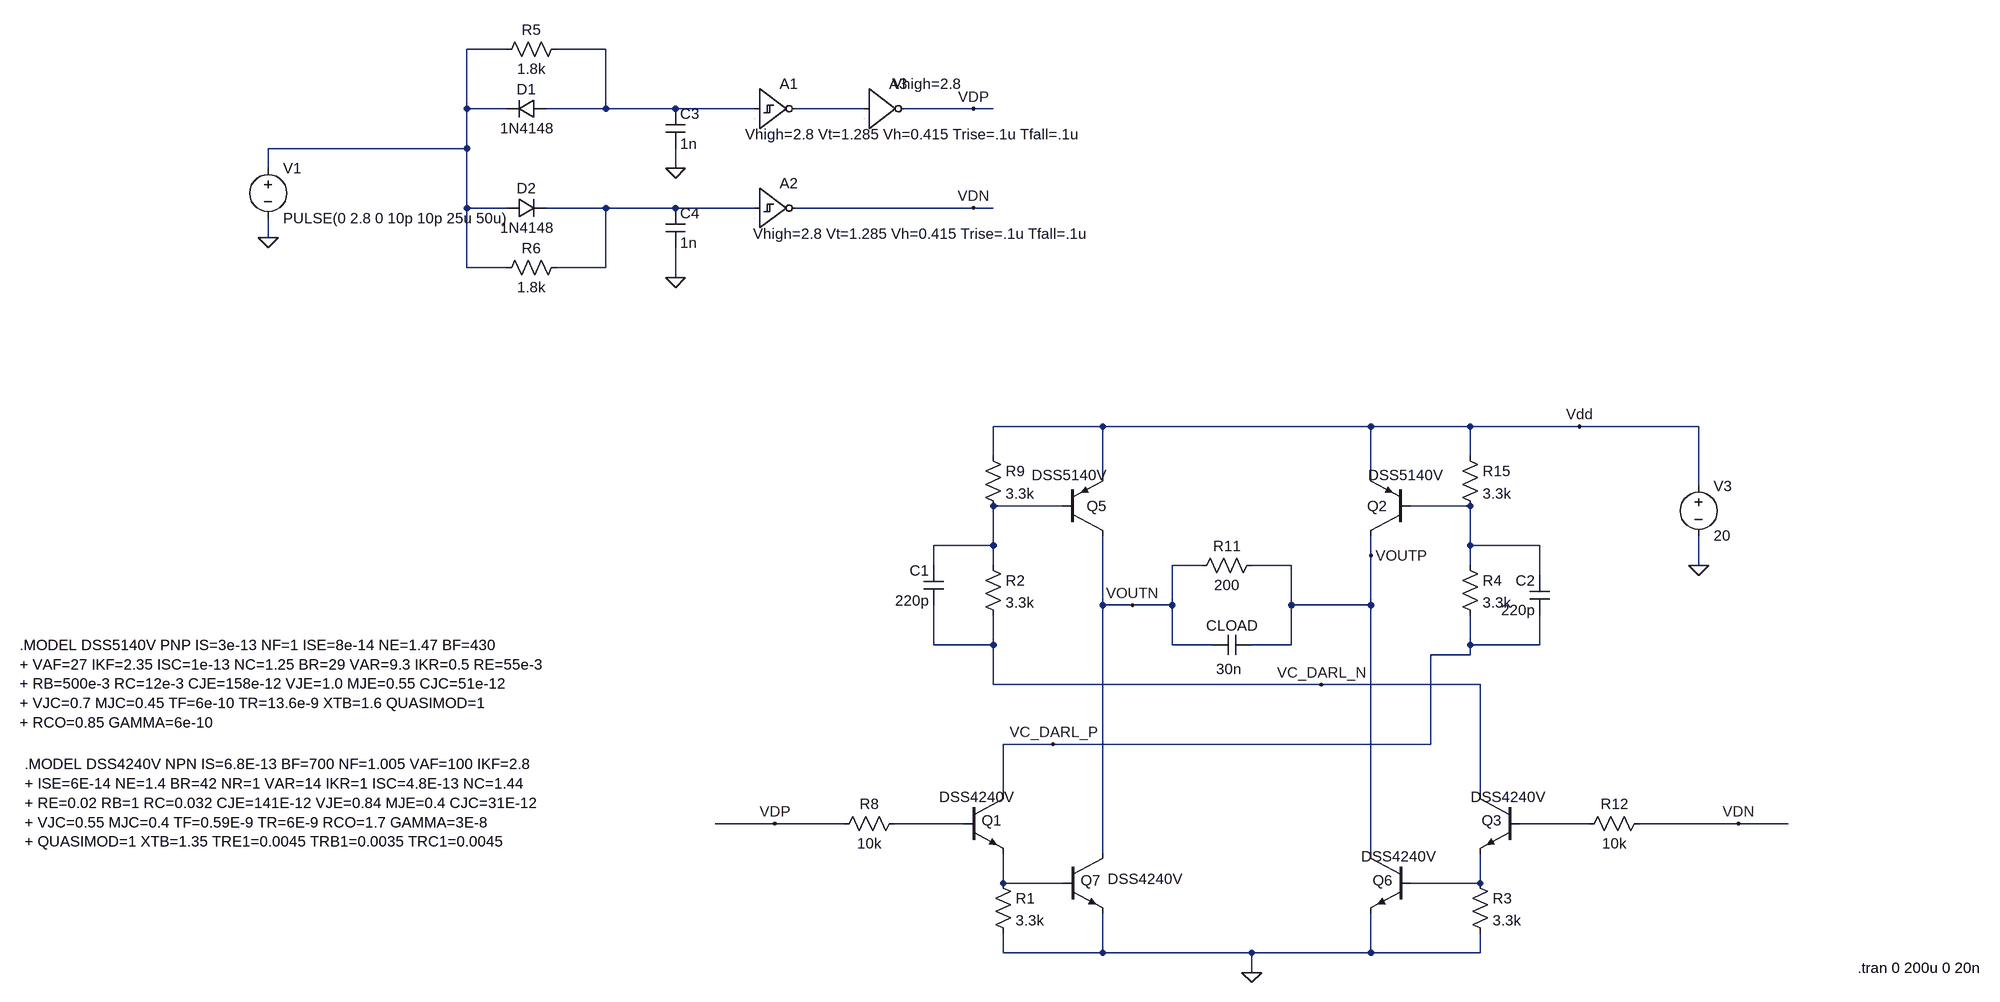
[diagram p0: schematic HbridgePiezo_bipolar.asc]
HbridgePiezo_bipolar.asc, the LTspice schematic file:
Version 4
SHEET 1 1368 680
WIRE -1136 -1296 -1200 -1296
WIRE -976 -1296 -1056 -1296
WIRE -1200 -1200 -1200 -1296
WIRE -1136 -1200 -1200 -1200
WIRE -976 -1200 -976 -1296
WIRE -976 -1200 -1072 -1200
WIRE -864 -1200 -976 -1200
WIRE -736 -1200 -864 -1200
WIRE -560 -1200 -672 -1200
WIRE -384 -1200 -496 -1200
WIRE -352 -1200 -384 -1200
WIRE -1200 -1136 -1200 -1200
WIRE -1200 -1136 -1520 -1136
WIRE -1520 -1104 -1520 -1136
WIRE -864 -1104 -864 -1136
WIRE -1200 -1040 -1200 -1136
WIRE -1136 -1040 -1200 -1040
WIRE -976 -1040 -1072 -1040
WIRE -864 -1040 -976 -1040
WIRE -736 -1040 -864 -1040
WIRE -384 -1040 -672 -1040
WIRE -352 -1040 -384 -1040
WIRE -1520 -992 -1520 -1024
WIRE -1200 -944 -1200 -1040
WIRE -1136 -944 -1200 -944
WIRE -976 -944 -976 -1040
WIRE -976 -944 -1056 -944
WIRE -864 -928 -864 -976
WIRE -176 -688 -352 -688
WIRE 256 -688 -176 -688
WIRE 416 -688 256 -688
WIRE 592 -688 416 -688
WIRE 784 -688 592 -688
WIRE -352 -640 -352 -688
WIRE 416 -640 416 -688
WIRE -176 -608 -176 -688
WIRE 256 -608 256 -688
WIRE 784 -592 784 -688
WIRE -240 -560 -352 -560
WIRE 416 -560 320 -560
WIRE -352 -496 -352 -560
WIRE -352 -496 -448 -496
WIRE 416 -496 416 -560
WIRE 528 -496 416 -496
WIRE 256 -480 256 -512
WIRE -448 -464 -448 -496
WIRE -352 -464 -352 -496
WIRE -16 -464 -64 -464
WIRE 128 -464 64 -464
WIRE 416 -464 416 -496
WIRE 784 -464 784 -512
WIRE 528 -448 528 -496
WIRE -176 -400 -176 -512
WIRE -128 -400 -176 -400
WIRE -64 -400 -64 -464
WIRE -64 -400 -128 -400
WIRE 128 -400 128 -464
WIRE 256 -400 256 -480
WIRE 256 -400 128 -400
WIRE -448 -336 -448 -400
WIRE -352 -336 -352 -384
WIRE -352 -336 -448 -336
WIRE -64 -336 -64 -400
WIRE 0 -336 -64 -336
WIRE 128 -336 128 -400
WIRE 128 -336 64 -336
WIRE 416 -336 416 -384
WIRE 528 -336 528 -384
WIRE 528 -336 416 -336
WIRE 416 -320 416 -336
WIRE 416 -320 352 -320
WIRE -352 -272 -352 -336
WIRE 176 -272 -352 -272
WIRE 432 -272 176 -272
WIRE -256 -176 -336 -176
WIRE 352 -176 352 -320
WIRE 352 -176 -256 -176
WIRE -336 -96 -336 -176
WIRE 432 -96 432 -272
WIRE -704 -48 -800 -48
WIRE -592 -48 -704 -48
WIRE -400 -48 -512 -48
WIRE 608 -48 496 -48
WIRE 848 -48 688 -48
WIRE 928 -48 848 -48
WIRE -176 0 -176 -400
WIRE 256 0 256 -400
WIRE -336 48 -336 0
WIRE -240 48 -336 48
WIRE 432 48 432 0
WIRE 432 48 320 48
WIRE -336 160 -336 128
WIRE -176 160 -176 96
WIRE -176 160 -336 160
WIRE 64 160 -176 160
WIRE 256 160 256 96
WIRE 256 160 64 160
WIRE 432 160 432 128
WIRE 432 160 256 160
WIRE 64 192 64 160
FLAG 784 -464 0
FLAG 64 192 0
FLAG 592 -688 Vdd
FLAG -704 -48 VDP
FLAG 848 -48 VDN
FLAG 256 -480 VOUTP
FLAG -128 -400 VOUTN
FLAG -864 -1104 0
FLAG -864 -928 0
FLAG -1520 -992 0
FLAG -384 -1200 VDP
FLAG -384 -1040 VDN
FLAG -256 -176 VC_DARL_P
FLAG 176 -272 VC_DARL_N
SYMBOL voltage -1520 -1120 R0
WINDOW 123 0 0 Left 2
WINDOW 39 0 0 Left 2
SYMATTR InstName V1
SYMATTR Value PULSE(0 2.8 0 10p 10p 25u 50u)
SYMBOL voltage 784 -608 R0
WINDOW 123 0 0 Left 2
WINDOW 39 24 124 Left 2
SYMATTR InstName V3
SYMATTR Value 20
SYMBOL res -352 32 R0
SYMATTR InstName R1
SYMATTR Value 3.3k
SYMATTR SpiceLine tol=1 pwr=0.0625
SYMBOL res 416 32 R0
SYMATTR InstName R3
SYMATTR Value 3.3k
SYMATTR SpiceLine tol=1 pwr=0.0625
SYMBOL res 400 -480 R0
SYMATTR InstName R4
SYMATTR Value 3.3k
SYMATTR SpiceLine tol=1 pwr=0.0625
SYMBOL diode -1072 -1216 R90
WINDOW 0 0 32 VBottom 2
WINDOW 3 32 32 VTop 2
SYMATTR InstName D1
SYMATTR Value 1N4148
SYMBOL diode -1136 -1024 R270
WINDOW 0 32 32 VTop 2
WINDOW 3 0 32 VBottom 2
SYMATTR InstName D2
SYMATTR Value 1N4148
SYMBOL res -1040 -1312 R90
WINDOW 0 0 56 VBottom 2
WINDOW 3 32 56 VTop 2
SYMATTR InstName R5
SYMATTR Value 1.8k
SYMATTR SpiceLine tol=5
SYMBOL res -1040 -960 R90
WINDOW 0 0 56 VBottom 2
WINDOW 3 32 56 VTop 2
SYMATTR InstName R6
SYMATTR Value 1.8k
SYMATTR SpiceLine tol=5
SYMBOL cap -880 -1200 R0
SYMATTR InstName C3
SYMATTR Value 1n
SYMBOL cap -880 -1040 R0
SYMATTR InstName C4
SYMATTR Value 1n
SYMBOL Digital\\schmtinv -736 -1264 R0
WINDOW 3 -16 105 Left 2
SYMATTR Value Vhigh=2.8 Vt=1.285 Vh=0.415 Trise=.1u Tfall=.1u
SYMATTR InstName A1
SYMBOL Digital\\schmtinv -736 -1104 R0
WINDOW 3 -3 105 Left 2
SYMATTR Value Vhigh=2.8 Vt=1.285 Vh=0.415 Trise=.1u Tfall=.1u
SYMATTR InstName A2
SYMBOL Digital\\inv -560 -1264 R0
WINDOW 3 45 24 Left 2
SYMATTR Value Vhigh=2.8
SYMATTR InstName A3
SYMBOL cap 64 -352 R90
WINDOW 0 0 32 VBottom 2
WINDOW 3 39 37 VTop 2
SYMATTR InstName CLOAD
SYMATTR Value 30n
SYMBOL npn 496 -96 M0
WINDOW 0 29 43 Left 2
WINDOW 3 -39 5 Left 2
SYMATTR InstName Q3
SYMATTR Value DSS4240V
SYMBOL res -496 -64 R90
WINDOW 0 0 56 VBottom 2
WINDOW 3 32 56 VTop 2
SYMATTR InstName R8
SYMATTR Value 10k
SYMATTR SpiceLine tol=1 pwr=0.0625
SYMBOL res 80 -480 R90
WINDOW 0 0 56 VBottom 2
WINDOW 3 32 56 VTop 2
SYMATTR InstName R11
SYMATTR Value 200
SYMBOL npn -400 -96 R0
WINDOW 0 29 43 Left 2
WINDOW 3 -39 5 Left 2
SYMATTR InstName Q1
SYMATTR Value DSS4240V
SYMBOL pnp 320 -512 R180
WINDOW 0 38 48 Left 2
WINDOW 3 -50 98 Left 2
SYMATTR InstName Q2
SYMATTR Value DSS5140V
SYMBOL pnp -240 -512 M180
WINDOW 0 38 48 Left 2
WINDOW 3 -50 98 Left 2
SYMATTR InstName Q5
SYMATTR Value DSS5140V
SYMBOL npn 320 0 M0
WINDOW 0 29 43 Left 2
WINDOW 3 -39 5 Left 2
SYMATTR InstName Q6
SYMATTR Value DSS4240V
SYMBOL npn -240 0 R0
WINDOW 0 29 43 Left 2
WINDOW 3 72 41 Left 2
SYMATTR InstName Q7
SYMATTR Value DSS4240V
SYMBOL res 704 -64 R90
WINDOW 0 0 56 VBottom 2
WINDOW 3 32 56 VTop 2
SYMATTR InstName R12
SYMATTR Value 10k
SYMATTR SpiceLine tol=1 pwr=0.0625
SYMBOL res -368 -656 R0
SYMATTR InstName R9
SYMATTR Value 3.3k
SYMATTR SpiceLine tol=1 pwr=0.0625
SYMBOL res 400 -656 R0
SYMATTR InstName R15
SYMATTR Value 3.3k
SYMATTR SpiceLine tol=1 pwr=0.0625
SYMBOL res -368 -480 R0
SYMATTR InstName R2
SYMATTR Value 3.3k
SYMATTR SpiceLine tol=1 pwr=0.0625
SYMBOL cap -432 -400 R180
WINDOW 0 24 56 Left 2
WINDOW 3 24 8 Left 2
SYMATTR InstName C1
SYMATTR Value 220p
SYMBOL cap 544 -384 R180
WINDOW 0 24 56 Left 2
WINDOW 3 24 8 Left 2
SYMATTR InstName C2
SYMATTR Value 220p
TEXT 1040 184 Left 2 !.tran 0 200u 0 20n
TEXT -1912 -144 Left 2 !.MODEL DSS4240V NPN IS=6.8E-13 BF=700 NF=1.005 VAF=100 IKF=2.8\n+ ISE=6E-14 NE=1.4 BR=42 NR=1 VAR=14 IKR=1 ISC=4.8E-13 NC=1.44\n+ RE=0.02 RB=1 RC=0.032 CJE=141E-12 VJE=0.84 MJE=0.4 CJC=31E-12\n+ VJC=0.55 MJC=0.4 TF=0.59E-9 TR=6E-9 RCO=1.7 GAMMA=3E-8\n+ QUASIMOD=1 XTB=1.35 TRE1=0.0045 TRB1=0.0035 TRC1=0.0045
TEXT -1920 -336 Left 2 !.MODEL DSS5140V PNP IS=3e-13 NF=1 ISE=8e-14 NE=1.47 BF=430\n+ VAF=27 IKF=2.35 ISC=1e-13 NC=1.25 BR=29 VAR=9.3 IKR=0.5 RE=55e-3\n+ RB=500e-3 RC=12e-3 CJE=158e-12 VJE=1.0 MJE=0.55 CJC=51e-12\n+ VJC=0.7 MJC=0.45 TF=6e-10 TR=13.6e-9 XTB=1.6 QUASIMOD=1\n+ RCO=0.85 GAMMA=6e-10

The netlist it stands for:
* HbridgePiezo_bipolar.asc
V1 N001 0 PULSE(0 2.8 0 10p 10p 25u 50u)
V3 Vdd 0 20
R1 N009 0 3.3k tol=1 pwr=0.0625
R3 N010 0 3.3k tol=1 pwr=0.0625
R4 N006 VC_DARL_P 3.3k tol=1 pwr=0.0625
D1 N002 N001 1N4148
D2 N001 N004 1N4148
R5 N002 N001 1.8k tol=5
R6 N004 N001 1.8k tol=5
C3 N002 0 1n
C4 N004 0 1n
A1 N002 0 0 0 0 N003 0 0 SCHMITT Vhigh=2.8 Vt=1.285 Vh=0.415 Trise=.1u Tfall=.1u
A2 N004 0 0 0 0 VDN 0 0 SCHMITT Vhigh=2.8 Vt=1.285 Vh=0.415 Trise=.1u Tfall=.1u
A3 N003 0 0 0 0 VDP 0 0 BUF Vhigh=2.8
CLOAD VOUTP VOUTN 30n
Q3 VC_DARL_N N008 N010 0 DSS4240V
R8 N007 VDP 10k tol=1 pwr=0.0625
R11 VOUTP VOUTN 200
Q1 VC_DARL_P N007 N009 0 DSS4240V
Q2 VOUTP N006 Vdd 0 DSS5140V
Q5 VOUTN N005 Vdd 0 DSS5140V
Q6 VOUTP N010 0 0 DSS4240V
Q7 VOUTN N009 0 0 DSS4240V
R12 VDN N008 10k tol=1 pwr=0.0625
R9 Vdd N005 3.3k tol=1 pwr=0.0625
R15 Vdd N006 3.3k tol=1 pwr=0.0625
R2 N005 VC_DARL_N 3.3k tol=1 pwr=0.0625
C1 VC_DARL_N N005 220p
C2 VC_DARL_P N006 220p
.model D D
.lib standard.dio
.model NPN NPN
.model PNP PNP
.lib standard.bjt
.tran 0 200u 0 20n
.MODEL DSS4240V NPN IS=6.8E-13 BF=700 NF=1.005 VAF=100 IKF=2.8
+ ISE=6E-14 NE=1.4 BR=42 NR=1 VAR=14 IKR=1 ISC=4.8E-13 NC=1.44
+ RE=0.02 RB=1 RC=0.032 CJE=141E-12 VJE=0.84 MJE=0.4 CJC=31E-12
+ VJC=0.55 MJC=0.4 TF=0.59E-9 TR=6E-9 RCO=1.7 GAMMA=3E-8
+ QUASIMOD=1 XTB=1.35 TRE1=0.0045 TRB1=0.0035 TRC1=0.0045
.MODEL DSS5140V PNP IS=3e-13 NF=1 ISE=8e-14 NE=1.47 BF=430
+ VAF=27 IKF=2.35 ISC=1e-13 NC=1.25 BR=29 VAR=9.3 IKR=0.5 RE=55e-3
+ RB=500e-3 RC=12e-3 CJE=158e-12 VJE=1.0 MJE=0.55 CJC=51e-12
+ VJC=0.7 MJC=0.45 TF=6e-10 TR=13.6e-9 XTB=1.6 QUASIMOD=1
+ RCO=0.85 GAMMA=6e-10
.backanno
.end